# EAGLE design brainwave_daughter_for_kossel_mini (EAGLE 6.4)
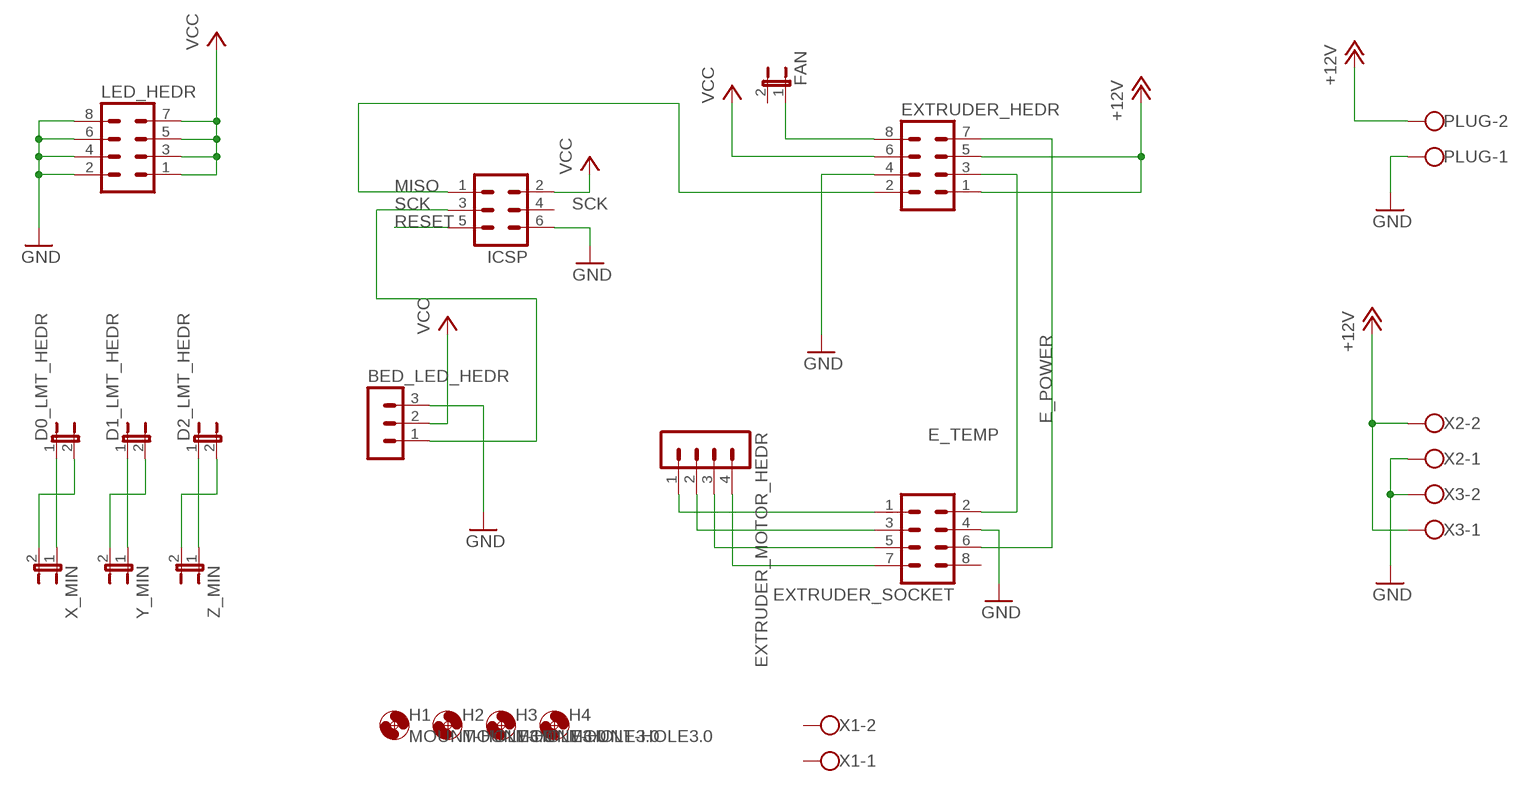
[diagram p0: schematic, sheet 1]

## Parts
BED_LED_HEDR  MA03-1  [MA03-1]
D0_LMT_HEDR  JP1E  [JP1]
D1_LMT_HEDR  JP1E  [JP1]
D2_LMT_HEDR  JP1E  [JP1]
EXTRUDER_HEDR  MA04-2  [MA04-2]
EXTRUDER_MOTOR_HEDR  MA04-1  [MA04-1]
EXTRUDER_SOCKET  MA04-2  [MA04-2]
FAN  JP1E  [JP1]
H1  MOUNT-HOLE3.0  [3,0]
H2  MOUNT-HOLE3.0  [3,0]
H3  MOUNT-HOLE3.0  [3,0]
H4  MOUNT-HOLE3.0  [3,0]
ICSP  MA03-2  [MA03-2]
LED_HEDR  MA04-2  [MA04-2]
PLUG  W237-102  [W237-102]
X1  W237-102  [W237-102]
X2  W237-102  [W237-102]
X3  W237-102  [W237-102]
X_MIN  JP1E  [JP1]
Y_MIN  JP1E  [JP1]
Z_MIN  JP1E  [JP1]

## Nets
+12V [Power]: EXTRUDER_HEDR.1 EXTRUDER_HEDR.5 PLUG.2 X2.2 X3.1
E_POWER [Power Bus]: EXTRUDER_HEDR.7 EXTRUDER_SOCKET.6
E_TEMP: EXTRUDER_HEDR.3 EXTRUDER_SOCKET.2
GND: BED_LED_HEDR.3 EXTRUDER_HEDR.4 EXTRUDER_SOCKET.4 ICSP.6 LED_HEDR.2 LED_HEDR.4 LED_HEDR.6 LED_HEDR.8 PLUG.1 X2.1 X3.2
MISO: EXTRUDER_HEDR.2 ICSP.1
N$1: D0_LMT_HEDR.1 X_MIN.1
N$2: D1_LMT_HEDR.1 Y_MIN.1
N$3: D2_LMT_HEDR.1 Z_MIN.1
N$4: D2_LMT_HEDR.2 Z_MIN.2
N$5: D1_LMT_HEDR.2 Y_MIN.2
N$6: D0_LMT_HEDR.2 X_MIN.2
N$7: EXTRUDER_HEDR.8 FAN.1
N$8: EXTRUDER_MOTOR_HEDR.1 EXTRUDER_SOCKET.1
N$9: EXTRUDER_MOTOR_HEDR.2 EXTRUDER_SOCKET.3
N$10: EXTRUDER_MOTOR_HEDR.3 EXTRUDER_SOCKET.5
N$11: EXTRUDER_MOTOR_HEDR.4 EXTRUDER_SOCKET.7
RESET: ICSP.5
SCK: BED_LED_HEDR.1 ICSP.3
VCC: BED_LED_HEDR.2 EXTRUDER_HEDR.6 ICSP.2 LED_HEDR.1 LED_HEDR.3 LED_HEDR.5 LED_HEDR.7
Unconnected: EXTRUDER_SOCKET.8 FAN.2 ICSP.4 X1.1 X1.2

## Library data of the parts
BED_LED_HEDR = con-lstb:MA03-1: PIN HEADER; OC_FARNELL: unknown; OC_NEWARK: unknown
D0_LMT_HEDR D1_LMT_HEDR D2_LMT_HEDR FAN X_MIN Y_MIN Z_MIN = jumper:JP1E: JUMPER
EXTRUDER_HEDR EXTRUDER_SOCKET LED_HEDR = con-lstb:MA04-2: PIN HEADER; OC_FARNELL: unknown; OC_NEWARK: unknown
EXTRUDER_MOTOR_HEDR = con-lstb:MA04-1: PIN HEADER; OC_FARNELL: unknown; OC_NEWARK: unknown
H1-H4 = holes:MOUNT-HOLE: MOUNTING HOLE with drill center marker
ICSP = con-lstb:MA03-2: PIN HEADER; OC_FARNELL: unknown; OC_NEWARK: unknown
PLUG X1-X3 = con-wago-500:W237-102: WAGO SCREW CLAMP; MPN: 237-102; OC_FARNELL: unknown; OC_NEWARK: 70K9898

## Net classes
0 default: width 0.178 mm, drill 0.406 mm, clearance 0.178 mm
1 Power: width 0.3 mm, drill 0.406 mm, clearance 0.178 mm
2 Power Bus: width 0.5 mm, drill 0.508 mm, clearance 0.178 mm
3 Bed Heat: width 1 mm, drill 0.508 mm, clearance 0.178 mm

## Board
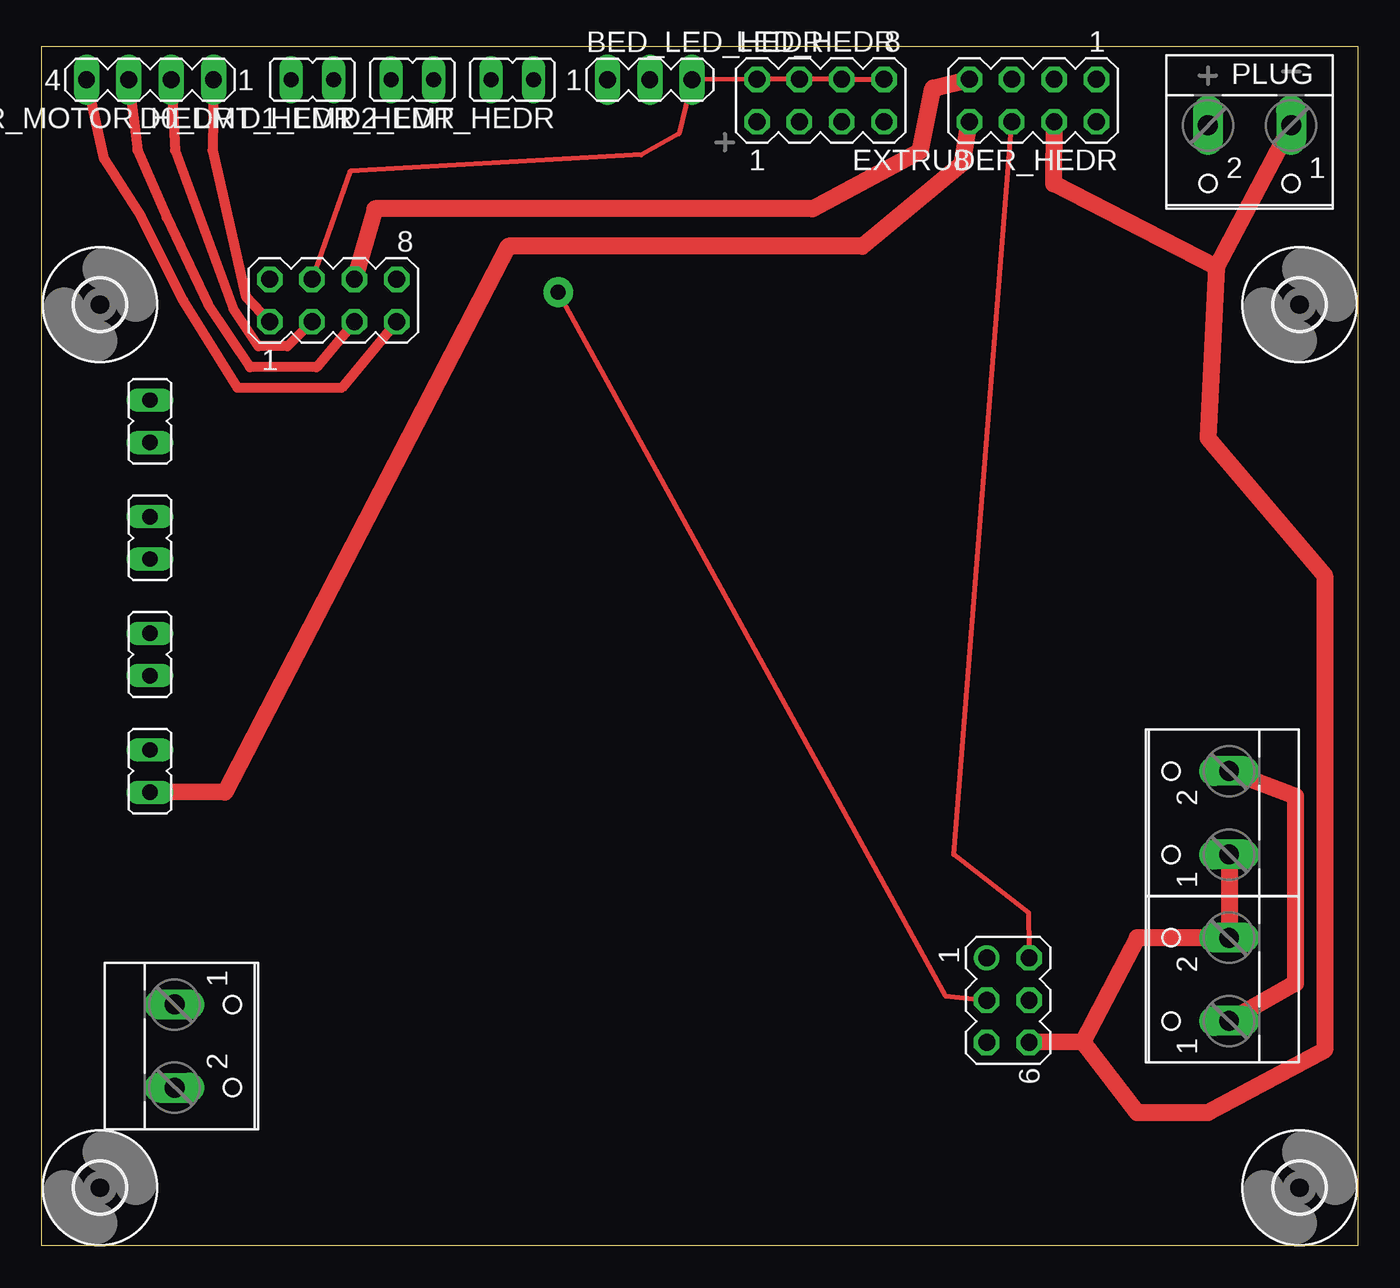
[diagram p1: board, top side]
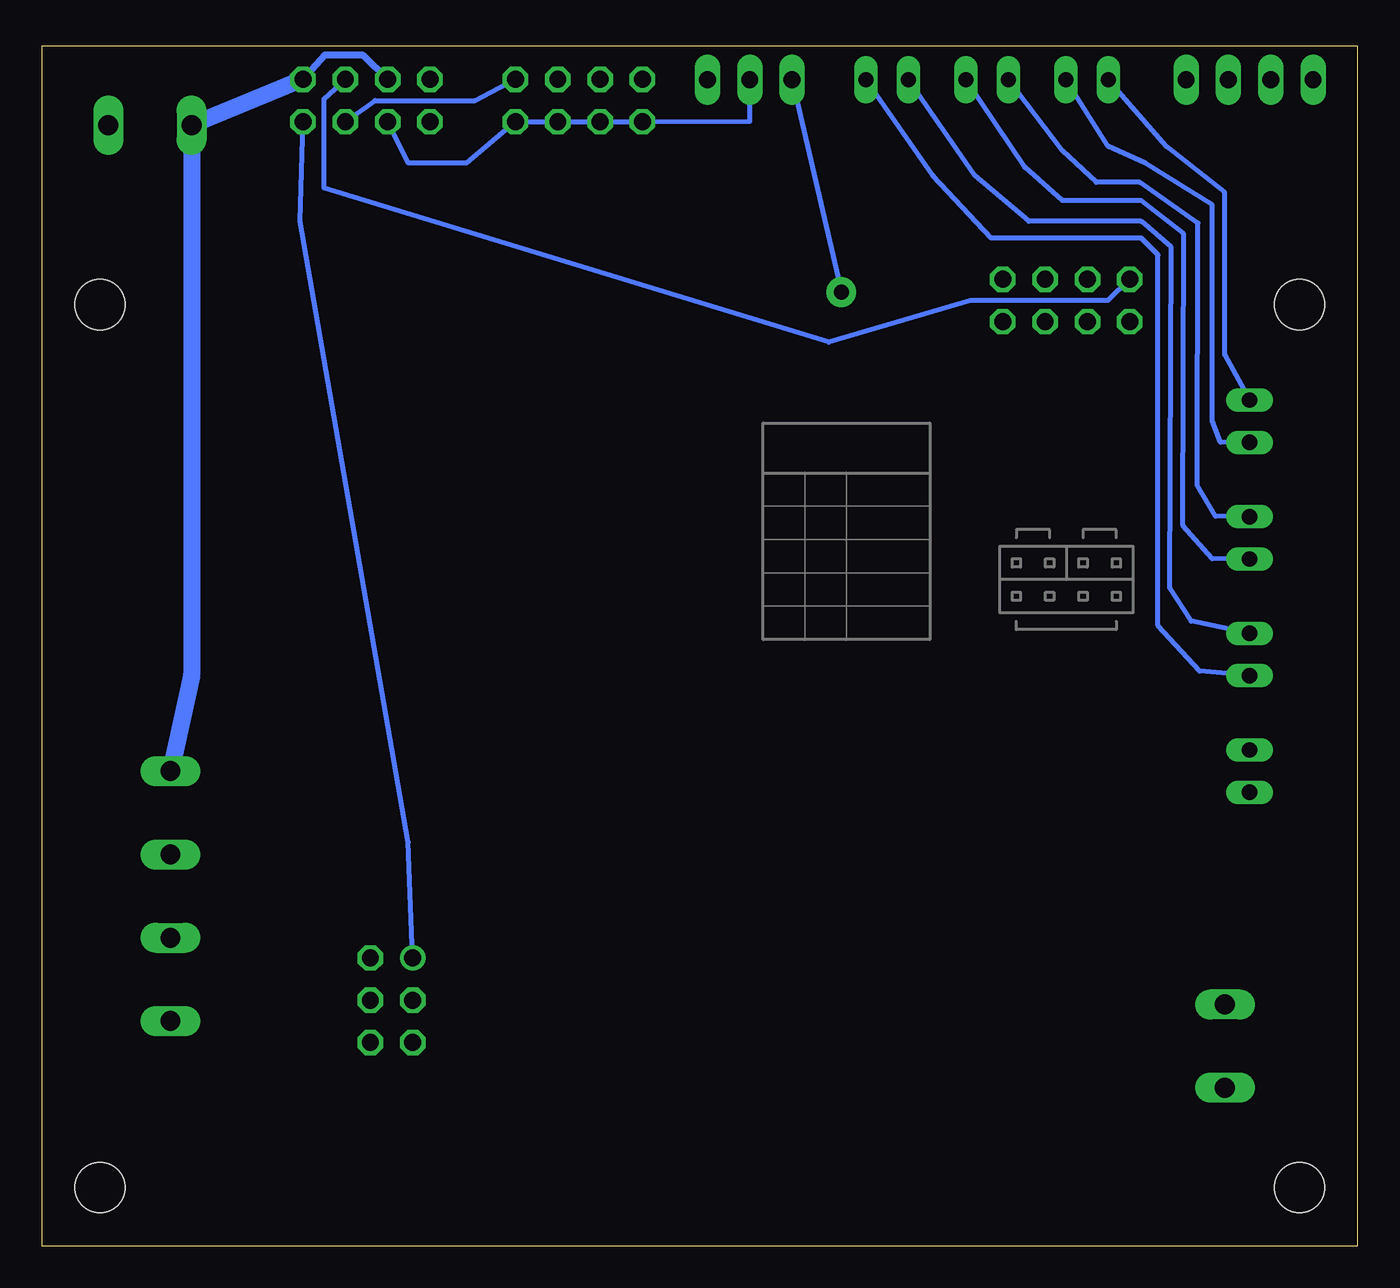
[diagram p2: board, bottom side, seen from below]

Size 79 x 72 mm. Coordinates in mm from the lower left corner, seen from the top.
Outline: 79,0 0,0 0,72 79,72 79,0
Copper layers (1*16): Top 0.035mm / dielectric 1.5mm / Bottom 0.035mm
Design rules "default": minimum track width 6mil, minimum drill 12mil, track to track 6mil, track to pad 6mil, pad to pad 6mil, via to via 6mil, smd to smd 0mil, copper to edge 10mil, drill to drill 10mil, minimum pad ring 10mil, minimum via ring 6mil, stop-mask expansion 2mil, vias tented up to drill 100mil, thermal gap 10mil

### Footprints (pad centres in the part's own frame; a part is rotated, then mirrored left to right if it is on the bottom)
MA03-1 = drill 1.016 long: 1 -2.54,0; 2 0,0; 3 2.54,0
JP1 = drill 0.914 long: 1 0,-1.27; 2 0,1.27
MA04-2 = drill 1.016 octagon: 1 -3.81,-1.27; 2 -3.81,1.27; 3 -1.27,-1.27; 4 -1.27,1.27; 5 1.27,-1.27; 6 1.27,1.27; 7 3.81,-1.27; 8 3.81,1.27
MA04-1 = drill 1.016 long: 1 -3.81,0; 2 -1.27,0; 3 1.27,0; 4 3.81,0
3,0 = hole 3: 0,0
MA03-2 = drill 1.016: 1 -2.54,-1.27 | drill 1.016 octagon: 2 -2.54,1.27; 3 0,-1.27; 4 0,1.27; 5 2.54,-1.27; 6 2.54,1.27
W237-102 = drill 1.194 long: 1 -2.5,-1.27; 2 2.5,-1.27

### Placement (x,y rotation side)
BED_LED_HEDR  36.5,70 0 top
D0_LMT_HEDR  16.25,70 90 top
D1_LMT_HEDR  22.25,70 90 top
D2_LMT_HEDR  28.25,70 90 top
EXTRUDER_HEDR  59.5,68.75 180 top
EXTRUDER_MOTOR_HEDR  6.5,70 180 top
EXTRUDER_SOCKET  17.5,56.75 0 top
FAN  6.5,28.5 0 top
H1  3.5,3.5 0 top
H2  3.5,56.5 0 top
H3  75.5,56.5 0 top
H4  75.5,3.5 0 top
ICSP  58,14.75 270 top
LED_HEDR  46.75,68.75 0 top
PLUG  72.5,66 180 top
X1  9.25,12 270 top
X2  70,26 90 top
X3  70,16 90 top
X_MIN  6.5,49.5 0 top
Y_MIN  6.5,42.5 0 top
Z_MIN  6.5,35.5 0 top

### Tracks (layer width: path | path; a pad name or v marks a point on that pad's centre or on a via)
+12V
  Top 1.016: X2.2 75.25,27 75.25,15.75 X3.1
  Bottom 0.406: EXTRUDER_HEDR.1 62,71.5 59.75,71.5 EXTRUDER_HEDR.5
  Bottom 1.016: EXTRUDER_HEDR.1 PLUG.2 70,34.25 X2.2
E_POWER
  Top 1.016: EXTRUDER_SOCKET.6 20,62.25 46.25,62.25 52.75,65.75 53.5,69.5 EXTRUDER_HEDR.7
E_TEMP
  Bottom 0.305: EXTRUDER_SOCKET.2 15,56.75 23.25,56.75 31.75,54.25 62.05,63.5 62.05,68.85 EXTRUDER_HEDR.3
GND
  Top 0.305: LED_HEDR.8 LED_HEDR.6 LED_HEDR.4 LED_HEDR.2 BED_LED_HEDR.3 38.25,66.75 36,65.5 18.5,64.5 EXTRUDER_SOCKET.4
  Top 1.016: PLUG.1 70.5,58.75 | 70.5,58.75 70,48.5 77,40.25 77,11.75 70,8 65.75,8 62.5,12.25 | 62.5,12.25 ICSP.6 | X2.1 X3.2 65.75,18.5 62.5,12.25 | 70.5,58.75 60.75,63.75 EXTRUDER_HEDR.4
  Bottom 0.305: EXTRUDER_HEDR.4 59,68.75 53,68.75 LED_HEDR.8
MISO
  Bottom 0.305: ICSP.1 57,24.25 63.5,61.5 EXTRUDER_HEDR.2
N$1
  Bottom 0.305: X_MIN.1 8.25,48.25 8.75,49.5 8.75,62.5 12.75,65 15,66 D0_LMT_HEDR.1
N$2
  Bottom 0.305: Y_MIN.1 8.75,41.25 10.5,43.25 10.45,60.75 13,62.75 17.75,62.75 20,64.75 D1_LMT_HEDR.1
N$3
  Bottom 0.305: Z_MIN.1 9.5,34.5 12,37.25 12,59.5 13,60.5 22,60.5 25.5,64.25 D2_LMT_HEDR.1
N$4
  Bottom 0.305: Z_MIN.2 10,37.5 11.3,39.5 11.2,59.95 13,61.5 19.75,61.5 23,64.25 D2_LMT_HEDR.2
N$5
  Bottom 0.305: Y_MIN.2 8.55,43.8 9.65,45.65 9.6,61.4 13.1,63.85 15.7,63.85 17.75,65.75 D1_LMT_HEDR.2
N$6
  Bottom 0.305: X_MIN.2 8,53.5 8,63.25 11.5,66 D0_LMT_HEDR.2
N$7
  Top 1.016: FAN.1 11,27.25 28,60 49.25,60 55.25,65 EXTRUDER_HEDR.8
N$8
  Top 0.61: EXTRUDER_SOCKET.1 12.25,57 10.25,65.75 EXTRUDER_MOTOR_HEDR.1
N$9
  Top 0.61: EXTRUDER_SOCKET.3 14.75,54 13,54 11.5,56.25 8,65.75 EXTRUDER_MOTOR_HEDR.2
N$10
  Top 0.61: EXTRUDER_SOCKET.5 16.5,52.75 12.5,52.75 10,56.5 7.5,61.75 5.75,65.75 EXTRUDER_MOTOR_HEDR.3
N$11
  Top 0.61: EXTRUDER_SOCKET.7 18,51.5 11.75,51.5 8.5,56.75 6,61.75 3.75,65.25 EXTRUDER_MOTOR_HEDR.4
RESET
  Top 0.178: ICSP.5 56.52,12.01
SCK  (via drill 0.9 pad 1.78)
  Top 0.305: v31,57.25 54.25,15 ICSP.3
  Bottom 0.305: BED_LED_HEDR.1 v31,57.25
VCC
  Top 0.178: 59.27,17.88 ICSP.2
  Top 0.305: 59.27,17.88 59.25,20 54.75,23.5 EXTRUDER_HEDR.6
  Bottom 0.305: BED_LED_HEDR.2 36.5,67.5 LED_HEDR.1 LED_HEDR.3 LED_HEDR.5 LED_HEDR.7 53.5,65 57,65 EXTRUDER_HEDR.6

### Text on the board
bDocu: Step Mode | mode | D2 | D1 | thermistor | heater | full | 0 | 0 | half | 0 | 1 | 16x | 1 | 0 | 32x | 1 | 1 | stepper | Main | 800mA | Max Motor Current: | Bed | 12v | Max Motor Voltage: | 6v | Min Motor Voltage: